# EAGLE design pwr-breakout (EAGLE 8.3.0)
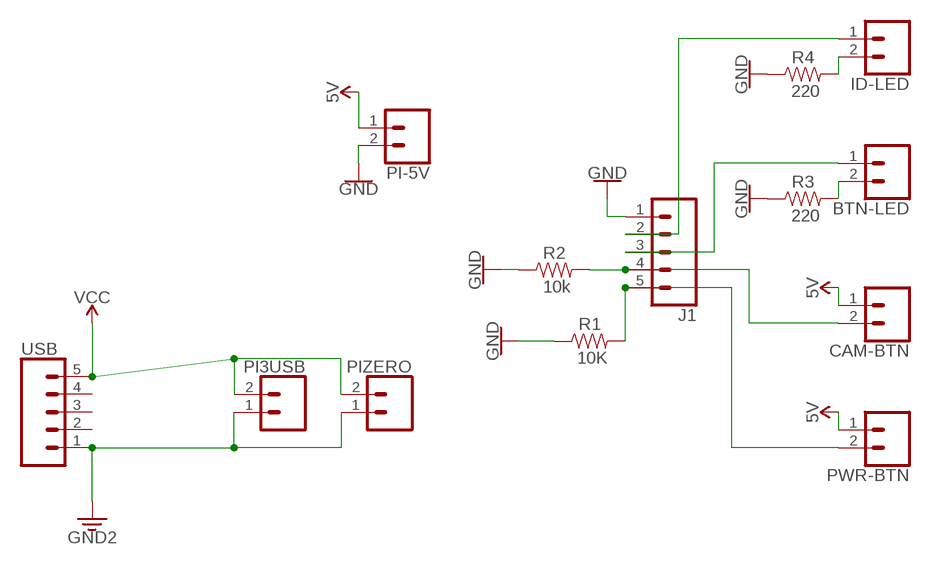
[diagram p0: schematic, sheet 1]

## Parts
BTN-LED  CONN_021X02_NO_SILK  [1X02_NO_SILK]
CAM-BTN  CONN_021X02_NO_SILK  [1X02_NO_SILK]
ID-LED  CONN_021X02_NO_SILK  [1X02_NO_SILK]
J1  CONN_05NO_SILK  [1X05_NO_SILK]
PI3USB  CONN_021X02_NO_SILK  [1X02_NO_SILK]
PI-5V  CONN_021X02_NO_SILK  [1X02_NO_SILK]
PIZERO  CONN_021X02_NO_SILK  [1X02_NO_SILK]
PWR-BTN  CONN_021X02_NO_SILK  [1X02_NO_SILK]
R1  10K  RESISTORAXIAL-0.3  [AXIAL-0.3]
R2  10k  RESISTORAXIAL-0.3  [AXIAL-0.3]
R3  220  RESISTORAXIAL-0.3  [AXIAL-0.3]
R4  220  RESISTORAXIAL-0.3  [AXIAL-0.3]
USB  CONN_05NO_SILK  [1X05_NO_SILK]

## Nets
3.3V: PI3USB.1 PIZERO.1 USB.1 ; supply symbol labelled GND2
5V: CAM-BTN.1 PI-5V.1 PWR-BTN.1
GND: J1.1 PI-5V.2 R1.P$1 R2.P$1 R3.P$1 R4.P$1
N$1: J1.5 PWR-BTN.2 R1.P$2
N$2: CAM-BTN.2 J1.4 R2.P$2
N$3: ID-LED.2 R4.P$2
N$4: BTN-LED.2 R3.P$2
N$7: BTN-LED.1 J1.3
N$8: ID-LED.1 J1.2
VCC: PI3USB.2 PIZERO.2 USB.5
Unconnected: USB.2 USB.3 USB.4

## Library data of the parts
BTN-LED CAM-BTN ID-LED PI3USB PI-5V PIZERO PWR-BTN = SparkFun-Connectors:CONN_02: Multi connection point. Often used as Generic Header-pin footprint for 0.1 inch spaced/style header connections On any of the 0.1 inch spaced packages, you can populate with these: Break Away Headers - Straight <https://www.sparkfun.com/products/116> (PRT-00116) Break Away Male Headers - Right Angle <https://www.sparkfun.com/products/553> (PRT-00553) Female Headers <https://www.sparkfun.com/products/115> (PRT-00115) Break Away Headers - Machine Pin <https://www.sparkfun.com/products/117> (PRT-00117) Break Away Female Headers - Swiss Machine Pin <https://www.sparkfun.com/products/743> (PRT-00743) For SCREWTERMINALS and SPRING TERMINALS visit here: Screw Terimnals on SparkFun.com <https://www.sparkfun.com/search/results?term=Screw+Terminals> (5mm/3.5mm/2.54mm spacing) This device is also useful as a general connection point to wire up your design to another part of your project. Our various solder wires solder well into these plated through hole pads. Hook-Up Wire - Assortment (Stranded, 22 AWG) <https://www.sparkfun.com/products/11375> (PRT-11375) Hook-Up Wire - Assortment (Solid Core, 22 AWG) <https://www.sparkfun.com/products/11367> (PRT-11367) View the entire wire category on our website here <https://www.sparkfun.com/categories/141> Special notes: Molex polarized connector foot print use with: PRT-08233 with associated crimp pins and housings. 2.54_SCREWTERM for use with PRT-10571. 3.5mm Screw Terminal footprints for PRT-08084 5mm Screw Terminal footprints for use with PRT-08432
J1 USB = SparkFun-Connectors:CONN_05: Multi connection point. Often used as Generic Header-pin footprint for 0.1 inch spaced/style header connections On any of the 0.1 inch spaced packages, you can populate with these: Break Away Headers - Straight <https://www.sparkfun.com/products/116> (PRT-00116) Break Away Male Headers - Right Angle <https://www.sparkfun.com/products/553> (PRT-00553) Female Headers <https://www.sparkfun.com/products/115> (PRT-00115) Break Away Headers - Machine Pin <https://www.sparkfun.com/products/117> (PRT-00117) Break Away Female Headers - Swiss Machine Pin <https://www.sparkfun.com/products/743> (PRT-00743) For SCREWTERMINALS and SPRING TERMINALS visit here: Screw Terimnals on SparkFun.com <https://www.sparkfun.com/search/results?term=Screw+Terminals> (5mm/3.5mm/2.54mm spacing) This device is also useful as a general connection point to wire up your design to another part of your project. Our various solder wires solder well into these plated through hole pads. Hook-Up Wire - Assortment (Stranded, 22 AWG) <https://www.sparkfun.com/products/11375> (PRT-11375) Hook-Up Wire - Assortment (Solid Core, 22 AWG) <https://www.sparkfun.com/products/11367> (PRT-11367) View the entire wire category on our website here <https://www.sparkfun.com/categories/141> Special notes: Molex polarized connector foot print use with SKU : PRT-08231 with associated crimp pins and housings. 1MM SMD Version SKU: PRT-10208
R1-R4 = SparkFun-Resistors:RESISTOR: Generic Resistor Package

## Board
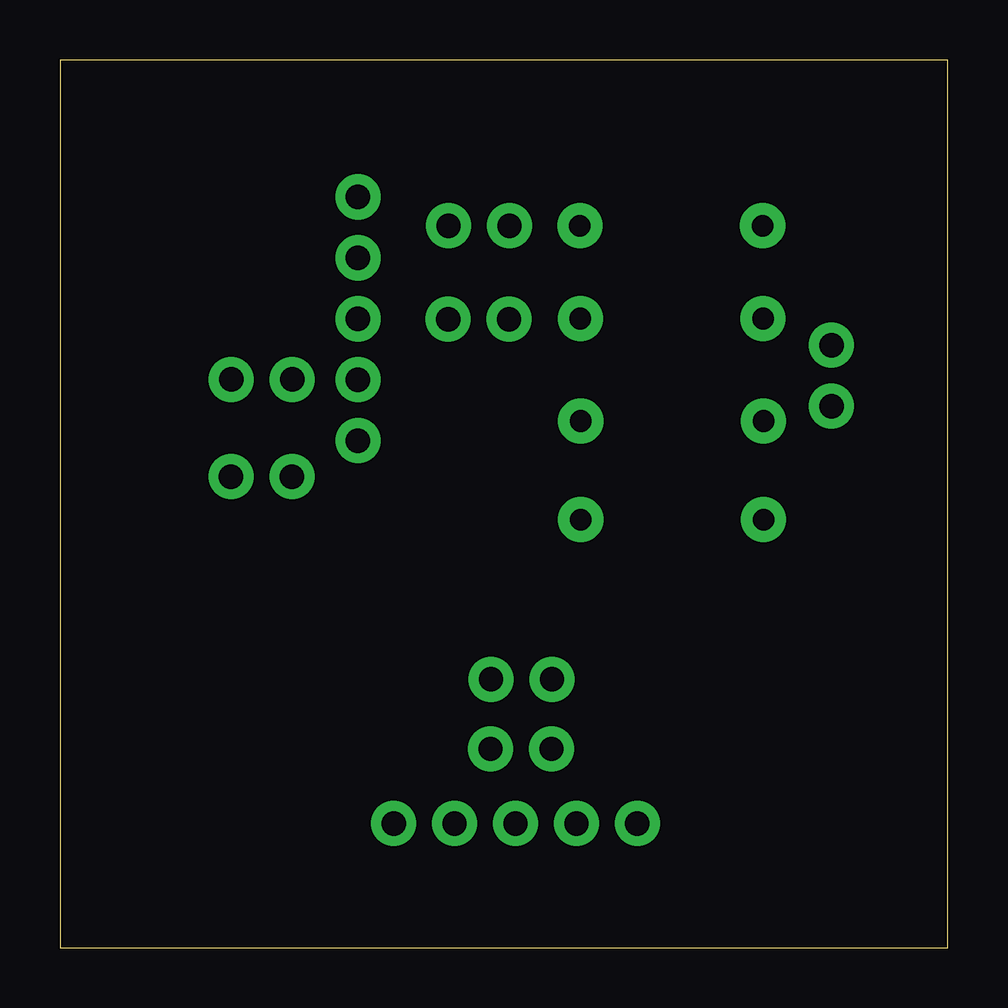
[diagram p1: board, top side]
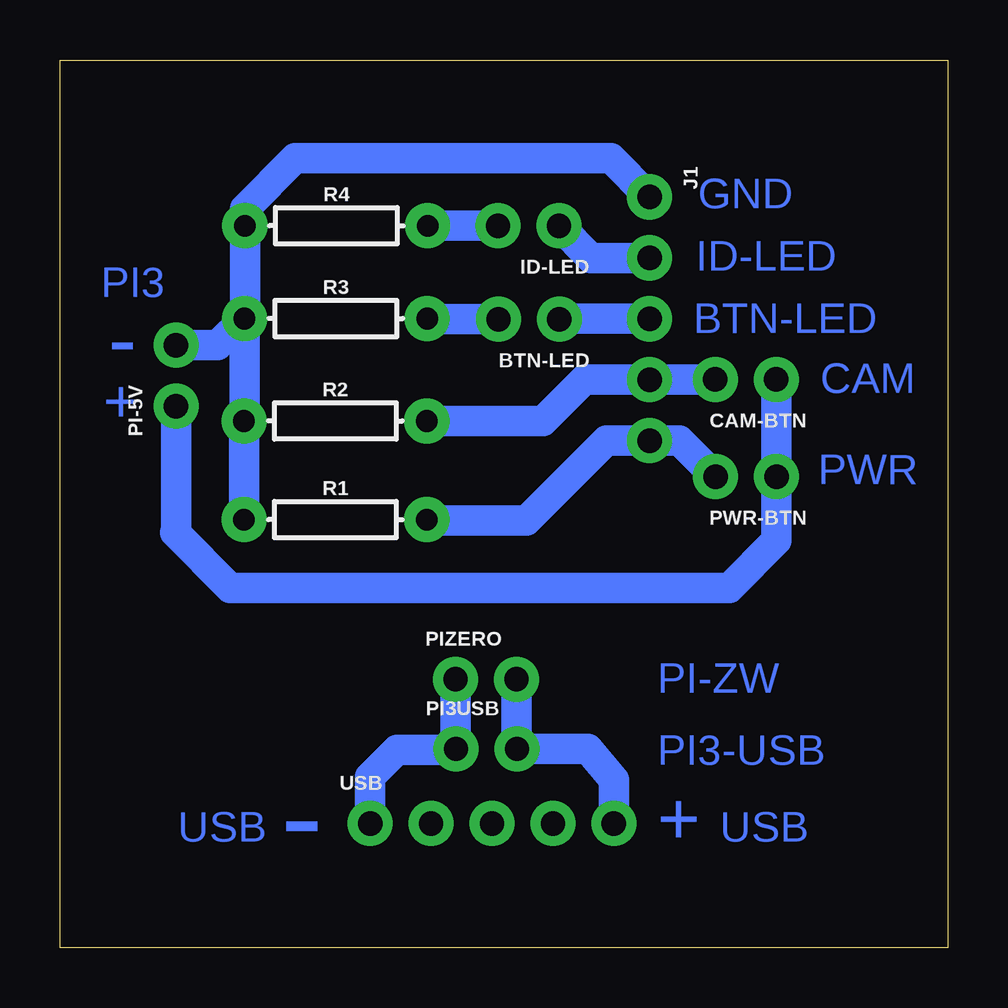
[diagram p2: board, bottom side, seen from below]

Size 37 x 37 mm. Coordinates in mm from the lower left corner, seen from the top.
Outline: 0,0 37,0 37,37 0,37 0,0
Copper layers (1*16): Top 0.035mm / dielectric 1.5mm / Bottom 0.035mm
Design rules "default": minimum track width 6mil, minimum drill 0.35mm, track to track 6mil, track to pad 6mil, pad to pad 6mil, via to via 6mil, smd to smd 6mil, copper to edge 40mil, drill to drill 6mil, minimum pad ring 10mil, minimum via ring 8mil, stop-mask expansion 4mil, vias tented up to drill 0mil, thermal gap 10mil

### Footprints (pad centres in the part's own frame; a part is rotated, then mirrored left to right if it is on the bottom)
1X02_NO_SILK = drill 1.016 pad 1.88: 1 0,0; 2 2.54,0
1X05_NO_SILK = drill 1.016 pad 1.88: 1 0,0; 2 2.54,0; 3 5.08,0; 4 7.62,0; 5 10.16,0
AXIAL-0.3 = drill 0.9 pad 1.88: P$1 -3.81,0; P$2 3.81,0

### Placement (x,y rotation side)
BTN-LED  16.18,26.19 180 bottom
CAM-BTN  7.14,23.68 180 bottom
ID-LED  16.2,30.09 180 bottom
J1  12.42,31.29 270 bottom
PI3USB  20.49,8.28 0 bottom
PI-5V  32.16,22.57 90 bottom
PIZERO  20.51,11.18 0 bottom
PWR-BTN  7.13,19.63 180 bottom
R1  25.52,17.84 0 bottom
R2  25.52,21.95 0 bottom
R3  25.5,26.22 0 bottom
R4  25.48,30.09 0 bottom
USB  24.07,5.17 0 bottom

### Tracks (layer width: path | path; a pad name or v marks a point on that pad's centre or on a via)
3.3V
  Bottom 1.27: PIZERO.1 20.51,8.3 PI3USB.1 20.53,8.24 22.95,8.24 24.07,7.12 USB.1
5V
  Bottom 1.27: CAM-BTN.1 PWR-BTN.1 7.13,16.97 9.1,15 29.9,15 32.2,17.3 32.16,17.34 PI-5V.1
GND
  Bottom 1.27: 29.29,26.24 R4.P$1 29.29,30.81 27.2,32.9 14.03,32.9 J1.1 | 29.29,26.24 R3.P$1 29.31,21.97 R2.P$1 R1.P$1 | PI-5V.2 30.42,25.11 29.29,26.24
N$1
  Bottom 1.27: R1.P$2 21.67,17.8 17.55,17.8 14.22,21.13 J1.5 11.17,21.13 PWR-BTN.2
N$2
  Bottom 1.27: R2.P$2 16.87,21.94 15.14,23.67 J1.4 CAM-BTN.2
N$3
  Bottom 1.27: ID-LED.2 R4.P$2
N$4
  Bottom 1.27: BTN-LED.2 21.66,26.19 R3.P$2
N$7
  Bottom 1.27: J1.3 16.16,26.21 BTN-LED.1
N$8
  Bottom 1.27: J1.2 14.86,28.75 ID-LED.1
VCC
  Bottom 1.27: PIZERO.2 17.97,8.3 PI3USB.2 14.98,8.28 13.9,7 USB.5

### Text on the board
Bottom: GND | ID-LED | PI3 | BTN-LED | - | CAM | + | PWR | PI-ZW | PI3-USB | USB | + | - | USB